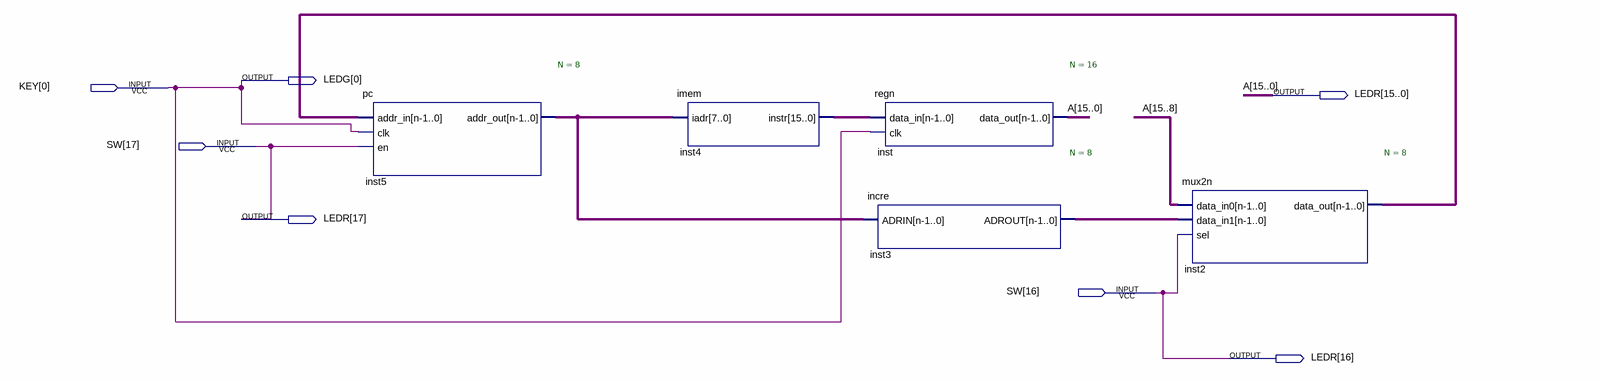
[diagram p0: schematic sheet]
// Quartus schematic td2.bdf as structural Verilog: 5 symbols, 7 pins
module td2 (
  input  [0:0] KEY,
  input  [17:16] SW,
  output [0:0] LEDG,
  output [17:0] LEDR
);

  wire [7:0] inst2_data_out, inst3_adrout, inst5_addr_out;
  wire [15:0] inst4_instr;

  pc #(.N(8)) inst5 (.addr_in(inst2_data_out), .clk(KEY[0]), .en(SW[17]), .addr_out(inst5_addr_out));
  imem inst4 (.iadr(inst5_addr_out), .instr(inst4_instr));
  regn #(.N(16)) inst (.data_in(inst4_instr), .clk(KEY[0]), .data_out(LEDR[15:0]));
  incre #(.N(8)) inst3 (.ADRIN(inst5_addr_out), .ADROUT(inst3_adrout));
  mux2n #(.N(8)) inst2 (.data_in0(LEDR[15:8]), .data_in1(inst3_adrout), .sel(SW[16]), .data_out(inst2_data_out));

  assign LEDG[0] = KEY[0];
  assign LEDR[17:16] = SW;

  // Other names for the same wires on the sheet: A[15:0] = LEDR[15:0]
endmodule
